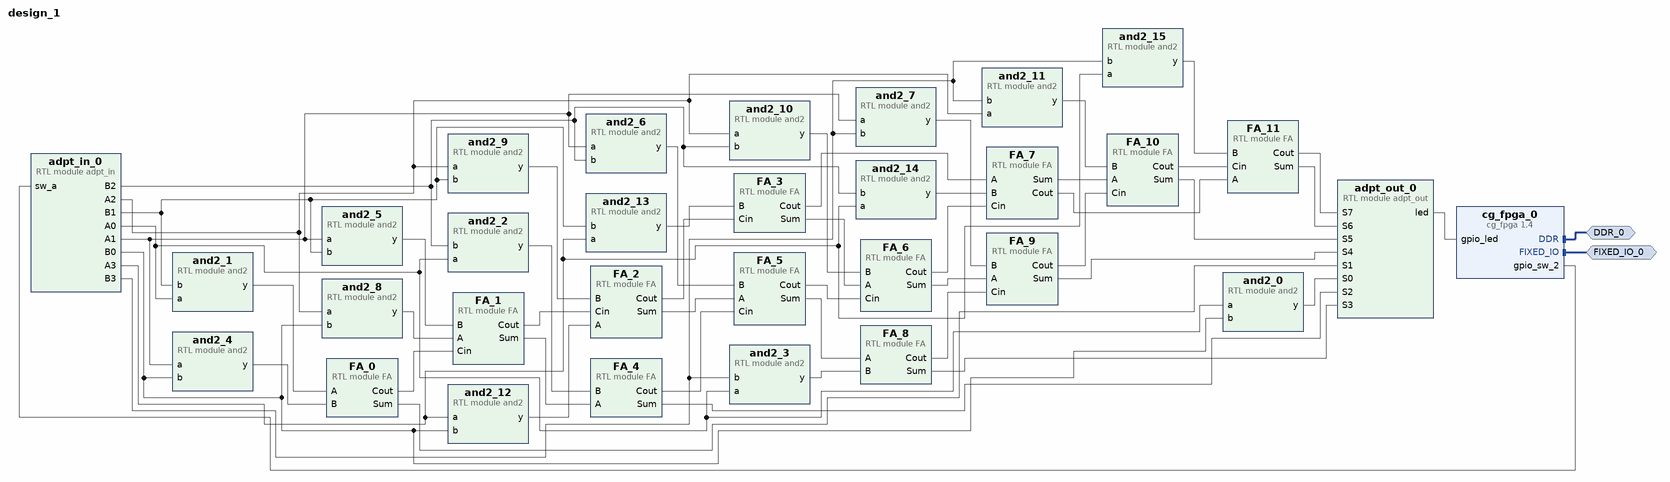
[diagram p0: block diagram of the top level]
# Vivado block design design_1, xc7z020clg400-1, Vivado 2025.2
create_bd_design design_1

create_bd_intf_port -mode Master -vlnv xilinx.com:display_processing_system7:fixedio_rtl:1.0 FIXED_IO_0
create_bd_intf_port -mode Master -vlnv xilinx.com:interface:ddrx_rtl:1.0 DDR_0

create_bd_cell -type ip -vlnv educg.net:user:cg_fpga:1.4 cg_fpga_0
create_bd_cell -type module -reference adpt_out adpt_out_0
create_bd_cell -type module -reference adpt_in adpt_in_0
create_bd_cell -type module -reference and2 and2_0
create_bd_cell -type module -reference and2 and2_1
create_bd_cell -type module -reference and2 and2_2
create_bd_cell -type module -reference and2 and2_3
create_bd_cell -type module -reference and2 and2_4
create_bd_cell -type module -reference and2 and2_5
create_bd_cell -type module -reference and2 and2_6
create_bd_cell -type module -reference and2 and2_7
create_bd_cell -type module -reference and2 and2_8
create_bd_cell -type module -reference and2 and2_9
create_bd_cell -type module -reference and2 and2_10
create_bd_cell -type module -reference and2 and2_11
create_bd_cell -type module -reference and2 and2_12
create_bd_cell -type module -reference and2 and2_13
create_bd_cell -type module -reference and2 and2_14
create_bd_cell -type module -reference and2 and2_15
create_bd_cell -type module -reference FA FA_0
create_bd_cell -type module -reference FA FA_1
create_bd_cell -type module -reference FA FA_2
create_bd_cell -type module -reference FA FA_3
create_bd_cell -type module -reference FA FA_4
create_bd_cell -type module -reference FA FA_5
create_bd_cell -type module -reference FA FA_6
create_bd_cell -type module -reference FA FA_7
create_bd_cell -type module -reference FA FA_8
create_bd_cell -type module -reference FA FA_9
create_bd_cell -type module -reference FA FA_10
create_bd_cell -type module -reference FA FA_11

# ---- connections ----

connect_bd_intf_net [get_bd_intf_ports DDR_0] [get_bd_intf_pins cg_fpga_0/DDR]
connect_bd_intf_net [get_bd_intf_ports FIXED_IO_0] [get_bd_intf_pins cg_fpga_0/FIXED_IO]
connect_bd_net [get_bd_pins FA_0/Cout] [get_bd_pins FA_1/Cin]
connect_bd_net [get_bd_pins FA_0/Sum] [get_bd_pins adpt_out_0/S1]
connect_bd_net [get_bd_pins FA_10/Cout] [get_bd_pins FA_11/Cin]
connect_bd_net [get_bd_pins FA_10/Sum] [get_bd_pins adpt_out_0/S5]
connect_bd_net [get_bd_pins FA_11/Cout] [get_bd_pins adpt_out_0/S7]
connect_bd_net [get_bd_pins FA_11/Sum] [get_bd_pins adpt_out_0/S6]
connect_bd_net [get_bd_pins FA_1/Cout] [get_bd_pins FA_2/Cin]
connect_bd_net [get_bd_pins FA_1/Sum] [get_bd_pins FA_4/A]
connect_bd_net [get_bd_pins FA_2/Cout] [get_bd_pins FA_3/Cin]
connect_bd_net [get_bd_pins FA_2/Sum] [get_bd_pins FA_5/A]
connect_bd_net [get_bd_pins FA_3/Cout] [get_bd_pins FA_7/A]
connect_bd_net [get_bd_pins FA_3/Sum] [get_bd_pins FA_6/A]
connect_bd_net [get_bd_pins FA_4/Cout] [get_bd_pins FA_5/Cin]
connect_bd_net [get_bd_pins FA_4/Sum] [get_bd_pins adpt_out_0/S2]
connect_bd_net [get_bd_pins FA_5/Cout] [get_bd_pins FA_6/Cin]
connect_bd_net [get_bd_pins FA_5/Sum] [get_bd_pins FA_8/A]
connect_bd_net [get_bd_pins FA_6/Cout] [get_bd_pins FA_7/Cin]
connect_bd_net [get_bd_pins FA_6/Sum] [get_bd_pins FA_9/A]
connect_bd_net [get_bd_pins FA_7/Cout] [get_bd_pins FA_11/A]
connect_bd_net [get_bd_pins FA_7/Sum] [get_bd_pins FA_10/A]
connect_bd_net [get_bd_pins FA_8/Cout] [get_bd_pins FA_9/Cin]
connect_bd_net [get_bd_pins FA_8/Sum] [get_bd_pins adpt_out_0/S3]
connect_bd_net [get_bd_pins FA_9/Cout] [get_bd_pins FA_10/Cin]
connect_bd_net [get_bd_pins FA_9/Sum] [get_bd_pins adpt_out_0/S4]
connect_bd_net [get_bd_pins adpt_in_0/A0] [get_bd_pins and2_0/a] [get_bd_pins and2_1/a] [get_bd_pins and2_2/a] [get_bd_pins and2_3/a]
connect_bd_net [get_bd_pins adpt_in_0/A1] [get_bd_pins and2_4/a] [get_bd_pins and2_5/a] [get_bd_pins and2_6/a] [get_bd_pins and2_7/a]
connect_bd_net [get_bd_pins adpt_in_0/A2] [get_bd_pins and2_8/a] [get_bd_pins and2_10/a] [get_bd_pins and2_9/a] [get_bd_pins and2_11/a]
connect_bd_net [get_bd_pins adpt_in_0/A3] [get_bd_pins and2_12/a] [get_bd_pins and2_13/a] [get_bd_pins and2_14/a] [get_bd_pins and2_15/a]
connect_bd_net [get_bd_pins adpt_in_0/B0] [get_bd_pins and2_0/b] [get_bd_pins and2_12/b] [get_bd_pins and2_8/b] [get_bd_pins and2_4/b]
connect_bd_net [get_bd_pins adpt_in_0/B1] [get_bd_pins and2_5/b] [get_bd_pins and2_9/b] [get_bd_pins and2_13/b] [get_bd_pins and2_1/b]
connect_bd_net [get_bd_pins adpt_in_0/B2] [get_bd_pins and2_10/b] [get_bd_pins and2_2/b] [get_bd_pins and2_6/b] [get_bd_pins and2_14/b]
connect_bd_net [get_bd_pins adpt_in_0/B3] [get_bd_pins and2_3/b] [get_bd_pins and2_7/b] [get_bd_pins and2_11/b] [get_bd_pins and2_15/b]
connect_bd_net [get_bd_pins adpt_out_0/led] [get_bd_pins cg_fpga_0/gpio_led]
connect_bd_net [get_bd_pins and2_0/y] [get_bd_pins adpt_out_0/S0]
connect_bd_net [get_bd_pins and2_10/y] [get_bd_pins FA_6/B]
connect_bd_net [get_bd_pins and2_11/y] [get_bd_pins FA_10/B]
connect_bd_net [get_bd_pins and2_12/y] [get_bd_pins FA_2/A]
connect_bd_net [get_bd_pins and2_13/y] [get_bd_pins FA_3/B]
connect_bd_net [get_bd_pins and2_14/y] [get_bd_pins FA_7/B]
connect_bd_net [get_bd_pins and2_15/y] [get_bd_pins FA_11/B]
connect_bd_net [get_bd_pins and2_1/y] [get_bd_pins FA_0/A]
connect_bd_net [get_bd_pins and2_2/y] [get_bd_pins FA_4/B]
connect_bd_net [get_bd_pins and2_3/y] [get_bd_pins FA_8/B]
connect_bd_net [get_bd_pins and2_4/y] [get_bd_pins FA_0/B]
connect_bd_net [get_bd_pins and2_5/y] [get_bd_pins FA_1/B]
connect_bd_net [get_bd_pins and2_6/y] [get_bd_pins FA_5/B]
connect_bd_net [get_bd_pins and2_7/y] [get_bd_pins FA_9/B]
connect_bd_net [get_bd_pins and2_8/y] [get_bd_pins FA_1/A]
connect_bd_net [get_bd_pins and2_9/y] [get_bd_pins FA_2/B]
connect_bd_net [get_bd_pins cg_fpga_0/gpio_sw_2] [get_bd_pins adpt_in_0/sw_a]

validate_bd_design
save_bd_design
